# Altium project merged_project.PrjPcb (part 3 of 3)

## Sheet stm32_schematic.SchDoc
size A3; SheetNumber: 3; SheetTotal: 3
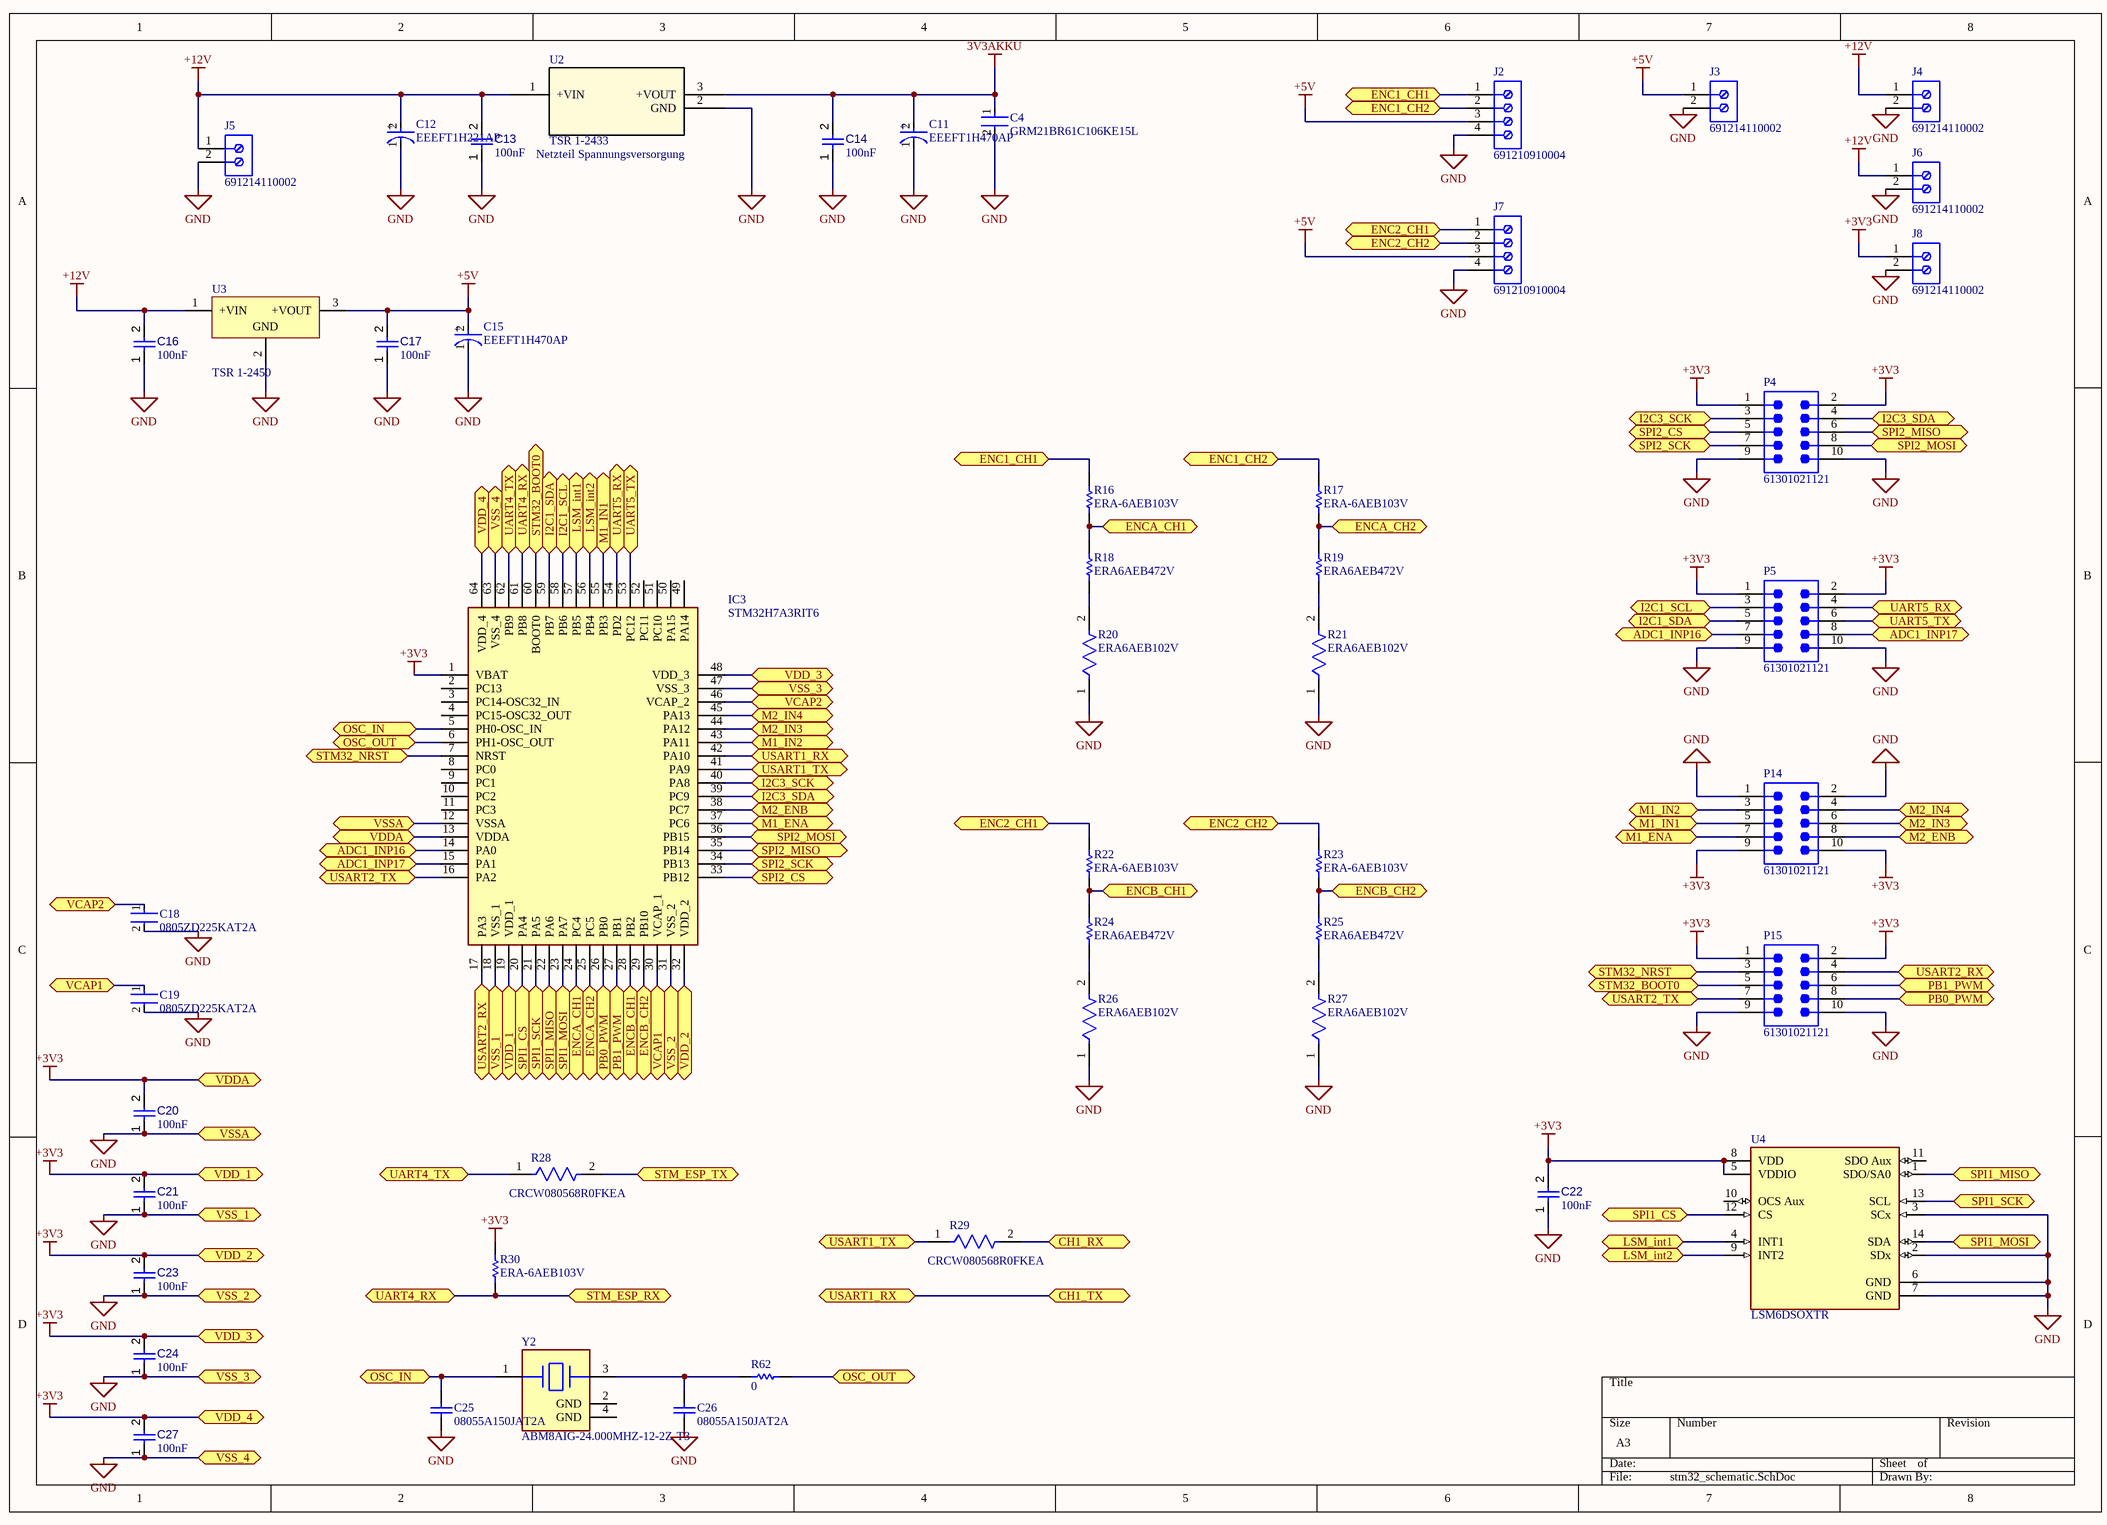
[diagram p4: stm32_schematic.SchDoc]

### Parts
C4  GRM21BR61C106KE15L  [FP-GRM21B-0_1-IPC_C]
C11  EEEFT1H470AP  [FP-FTD-MFG]
C12  EEEFT1H221AP  [FP-FTF-MFG]
C13  value 100nF  [CAPC2013X95X50LL10T25]  (hidden comment: Capacitor 100 nF +/-10% 50 V 0805)
C14  value 100nF  [CAPC2013X95X50LL10T25]  (hidden comment: Capacitor 100 nF +/-10% 50 V 0805)
C15  EEEFT1H470AP  [FP-FTD-MFG]
C16  value 100nF  [CAPC2013X95X50LL10T25]  (hidden comment: Capacitor 100 nF +/-10% 50 V 0805)
C17  value 100nF  [CAPC2013X95X50LL10T25]  (hidden comment: Capacitor 100 nF +/-10% 50 V 0805)
C18  0805ZD225KAT2A  [FP-0805-L_2_01_0_2-W_1_25-IPC_B]
C19  0805ZD225KAT2A  [FP-0805-L_2_01_0_2-W_1_25-IPC_B]
C20  value 100nF  [CAPC2013X95X50LL10T25]  (hidden comment: Capacitor 100 nF +/-10% 50 V 0805)
C21  value 100nF  [CAPC2013X95X50LL10T25]  (hidden comment: Capacitor 100 nF +/-10% 50 V 0805)
C22  value 100nF  [CAPC2013X95X50LL10T25]  (hidden comment: Capacitor 100 nF +/-10% 50 V 0805)
C23  value 100nF  [CAPC2013X95X50LL10T25]  (hidden comment: Capacitor 100 nF +/-10% 50 V 0805)
C24  value 100nF  [CAPC2013X95X50LL10T25]  (hidden comment: Capacitor 100 nF +/-10% 50 V 0805)
C25  08055A150JAT2A  [CAPC2013X140X50LL20T25]
C26  08055A150JAT2A  [CAPC2013X140X50LL20T25]
C27  value 100nF  [CAPC2013X95X50LL10T25]  (hidden comment: Capacitor 100 nF +/-10% 50 V 0805)
IC3  STM32H7A3RIT6  [QFP50P1200X1200X160-64N]
J2  691210910004  [691210910004]
J3  691214110002  [691214110002]
J4  691214110002  [691214110002]
J5  691214110002  [691214110002]
J6  691214110002  [691214110002]
J7  691210910004  [691210910004]
J8  691214110002  [691214110002]
P4  61301021121  [61301021121]
P5  61301021121  [61301021121]
P14  61301021121  [61301021121]
P15  61301021121  [61301021121]
R16  ERA-6AEB103V  [RESC2013X60X40LL20T25_A]
R17  ERA-6AEB103V  [RESC2013X60X40LL20T25_A]
R18  ERA6AEB472V  [RESC2013X60X40ML20T25]
R19  ERA6AEB472V  [RESC2013X60X40ML20T25]
R20  ERA6AEB102V  [FP-ERA6A-IPC_C]
R21  ERA6AEB102V  [FP-ERA6A-IPC_C]
R22  ERA-6AEB103V  [RESC2013X60X40LL20T25_A]
R23  ERA-6AEB103V  [RESC2013X60X40LL20T25_A]
R24  ERA6AEB472V  [RESC2013X60X40ML20T25]
R25  ERA6AEB472V  [RESC2013X60X40ML20T25]
R26  ERA6AEB102V  [FP-ERA6A-IPC_C]
R27  ERA6AEB102V  [FP-ERA6A-IPC_C]
R28  CRCW080568R0FKEA  [FP-CRCW0805-e3-IPC_C]
R29  CRCW080568R0FKEA  [FP-CRCW0805-e3-IPC_C]
R30  ERA-6AEB103V  [RESC2013X60X40LL20T25_A]
R62  value 0  [RESC2013X60X35ML10T20]  (hidden comment: Resistor 0R +/- 5% 0805 125 mW)
U2  TSR 1-2433  [TSR1-SINGLE_TRP]
U3  TSR 1-2450  [TRACO-SIP-3_V]
U4  LSM6DSOXTR  [FP-LGA-14L-DM00249496-MFG]
Y2  ABM8AIG-24.000MHZ-12-2Z-T3  [FP-ABM8AIG-MFG]

### Ports
ADC1_INP16 (bidir), ADC1_INP17 (bidir), CH1_RX (bidir), CH1_TX (bidir), ENC1_CH1 (bidir), ENC1_CH2 (bidir), ENC2_CH1 (bidir), ENC2_CH2 (bidir), ENCA_CH1 (bidir), ENCA_CH2 (bidir), ENCB_CH1 (bidir), ENCB_CH2 (bidir), I2C1_SCL (bidir), I2C1_SDA (bidir), I2C3_SCK (bidir), I2C3_SDA (bidir), LSM_int1 (bidir), LSM_int2 (bidir), M1_ENA (bidir), M1_IN1 (bidir), M1_IN2 (bidir), M2_ENB (bidir), M2_IN3 (bidir), M2_IN4 (bidir), OSC_IN (bidir), OSC_OUT (bidir), PB0_PWM (bidir), PB1_PWM (bidir), SPI1_CS (bidir), SPI1_MISO (bidir), SPI1_MOSI (bidir), SPI1_SCK (bidir), SPI2_CS (bidir), SPI2_MISO (bidir), SPI2_MOSI (bidir), SPI2_SCK (bidir), STM32_BOOT0 (bidir), STM32_NRST (bidir), STM_ESP_RX (bidir), STM_ESP_TX (bidir), UART4_RX (bidir), UART4_TX (bidir), UART5_RX (bidir), UART5_TX (bidir), USART1_RX (bidir), USART1_TX (bidir), USART2_RX (bidir), USART2_TX (bidir), VCAP1 (bidir), VCAP2 (bidir), VDD_1 (bidir), VDD_2 (bidir), VDD_3 (bidir), VDD_4 (bidir), VDDA (bidir), VSS_1 (bidir), VSS_2 (bidir), VSS_3 (bidir), VSS_4 (bidir), VSSA (bidir)

### Nets
3V3AKKU: C4.1 C11.2(A) C14.2 U2.3(+VOUT)
+3V3: C20.2 C21.2 C22.2 C23.2 C24.2 C27.2 IC3.1(VBAT) IC3.13(VDDA) IC3.19(VDD_1) IC3.32(VDD_2) IC3.48(VDD_3) IC3.64(VDD_4) J8.1 P4.1 P4.2 P5.1 P5.2 P14.9 P14.10 P15.1 P15.2 R30.2 U4.5(VDDIO) U4.8(VDD) ; port VDDA, port VDD_1, port VDD_2, port VDD_3, port VDD_4
+5V: C15.2(A) C17.2 J2.3 J3.1 J7.3 U3.3(+VOUT)
+12V: C12.2(A) C13.2 C16.2 J4.1 J5.1 J6.1 U2.1(+VIN) U3.1(+VIN)
GND: C4.2 C11.1(C) C12.1(C) C13.1 C14.1 C15.1(C) C16.1 C17.1 C18.2 C19.2 C20.1 C21.1 C22.1 C23.1 C24.1 C25.1 C26.1 C27.1 IC3.12(VSSA) IC3.18(VSS_1) IC3.31(VSS_2) IC3.47(VSS_3) IC3.63(VSS_4) J2.4 J3.2 J4.2 J5.2 J6.2 J7.4 J8.2 P4.9 P4.10 P5.9 P5.10 P14.1 P14.2 P15.9 P15.10 R20.1 R21.1 R26.1 R27.1 U2.2(GND) U3.2(GND) U4.2(SDx) U4.3(SCx) U4.6(GND) U4.7(GND) ; port VSSA, port VSS_1, port VSS_2, port VSS_3, port VSS_4
NetC18_1: C18.1 IC3.46(VCAP_2) ; port VCAP2
NetC19_1: C19.1 IC3.30(VCAP_1) ; port VCAP1
NetC25_2: C25.2 IC3.5(PH0-OSC_IN) Y2.1 ; port OSC_IN
NetC26_2: C26.2 R62.1 Y2.3
NetIC3_6: IC3.6(PH1-OSC_OUT) R62.2 ; port OSC_OUT
NetIC3_7: IC3.7(NRST) P15.3 ; port STM32_NRST
NetIC3_14: IC3.14(PA0) P5.7 ; port ADC1_INP16
NetIC3_15: IC3.15(PA1) P5.8 ; port ADC1_INP17
NetIC3_16: IC3.16(PA2) P15.7 ; port USART2_TX
NetIC3_17: IC3.17(PA3) P15.4 ; port USART2_RX
NetIC3_20: IC3.20(PA4) U4.12(CS) ; port SPI1_CS
NetIC3_21: IC3.21(PA5) U4.13(SCL) ; port SPI1_SCK
NetIC3_22: IC3.22(PA6) U4.1(SDO/SA0) ; port SPI1_MISO
NetIC3_23: IC3.23(PA7) U4.14(SDA) ; port SPI1_MOSI
NetIC3_24: IC3.24(PC4) R16.1 R18.2 ; port ENCA_CH1
NetIC3_25: IC3.25(PC5) R17.1 R19.2 ; port ENCA_CH2
NetIC3_26: IC3.26(PB0) P15.8 ; port PB0_PWM
NetIC3_27: IC3.27(PB1) P15.6 ; port PB1_PWM
NetIC3_28: IC3.28(PB2) R22.1 R24.2 ; port ENCB_CH1
NetIC3_29: IC3.29(PB10) R23.1 R25.2 ; port ENCB_CH2
NetIC3_33: IC3.33(PB12) P4.5 ; port SPI2_CS
NetIC3_34: IC3.34(PB13) P4.7 ; port SPI2_SCK
NetIC3_35: IC3.35(PB14) P4.6 ; port SPI2_MISO
NetIC3_36: IC3.36(PB15) P4.8 ; port SPI2_MOSI
NetIC3_37: IC3.37(PC6) P14.7 ; port M1_ENA
NetIC3_38: IC3.38(PC7) P14.8 ; port M2_ENB
NetIC3_39: IC3.39(PC9) P4.4 ; port I2C3_SDA
NetIC3_40: IC3.40(PA8) P4.3 ; port I2C3_SCK
NetIC3_41: IC3.41(PA9) R29.1 ; port USART1_TX
NetIC3_42: IC3.42(PA10) ; port CH1_TX, port USART1_RX
NetIC3_43: IC3.43(PA11) P14.3 ; port M1_IN2
NetIC3_44: IC3.44(PA12) P14.6 ; port M2_IN3
NetIC3_45: IC3.45(PA13) P14.4 ; port M2_IN4
NetIC3_53: IC3.53(PC12) P5.6 ; port UART5_TX
NetIC3_54: IC3.54(PD2) P5.4 ; port UART5_RX
NetIC3_55: IC3.55(PB3) P14.5 ; port M1_IN1
NetIC3_56: IC3.56(PB4) U4.9(INT2) ; port LSM_int2
NetIC3_57: IC3.57(PB5) U4.4(INT1) ; port LSM_int1
NetIC3_58: IC3.58(PB6) P5.3 ; port I2C1_SCL
NetIC3_59: IC3.59(PB7) P5.5 ; port I2C1_SDA
NetIC3_60: IC3.60(BOOT0) P15.5 ; port STM32_BOOT0
NetIC3_61: IC3.61(PB8) R30.1 ; port STM_ESP_RX, port UART4_RX
NetIC3_62: IC3.62(PB9) R28.1 ; port UART4_TX
NetJ2_1: J2.1 R16.2 ; port ENC1_CH1
NetJ2_2: J2.2 R17.2 ; port ENC1_CH2
NetJ7_1: J7.1 R22.2 ; port ENC2_CH1
NetJ7_2: J7.2 R23.2 ; port ENC2_CH2
NetR18_1: R18.1 R20.2
NetR19_1: R19.1 R21.2
NetR24_1: R24.1 R26.2
NetR25_1: R25.1 R27.2
NetR28_2: R28.2 ; port STM_ESP_TX
NetR29_2: R29.2 ; port CH1_RX

Not connected (* = marked no-connect by the designer): IC3 2(PC13) 3(PC14-OSC32_IN) 4(PC15-OSC32_OUT) 8(PC0) 9(PC1) 10(PC2) 11(PC3) 49(PA14) 50(PA15) 51(PC10) 52(PC11); U4 10(OCS_Aux) 11(SDO_Aux); Y2 2(GND) 4(GND)

### Notes on the sheet
- Netzteil Spannungsversorgung
- (in symbol CMP-05427-000060-1) +
- (in symbol CMP-05427-000092-1) +

### Library data of the parts
C4 = CMP-2007-03453-2: Chip Multilayer Ceramic Capacitors for General Purpose, 0805, 10uF, X5R, 15%, 10%, 16V; Radiation Hardening: No; Thickness: 0.053inch; Voltage Rating (DC): 16V; Lead Free: Lead Free; Package Quantity: 1; Width: 1.25mm; Case Code (Imperial): 0805; Depth: 1.25mm; Packaging: Tape and Reel; Dielectric: X5R; Max Operating Temperature: 85°C; Tolerance: 10%; Voltage Rating: 16V; Voltage: 16V; Capacitance: 10uF; Height: 1.25mm; Case Code (Metric): 2012; Material: Ceramic; Mount: Surface Mount; Case/Package: 0805; REACH SVHC: No SVHC; Length: 2mm; Min Operating Temperature: -55°C; Termination: SMD/SMT
C11 C15 = CMP-05427-000060-1: CAP ALUM 47UF 20% 50V SMD; ESR (Equivalent Series Resistance): 680mR; Ripple Current (AC): 195mA; Dielectric Material: Aluminium; Leakage Current: 23.5uA; Life (Hours): 2000Hour; Lead Diameter: 0.65mm; Lead Pitch: 1.8mm; Voltage: 50V; Min Operating Temperature: -55°C; Capacitance: 47uF; Radiation Hardening: No; Series: FT; Contact Plating: Tin; Mount: Surface Mount; REACH SVHC: No SVHC; RoHS Compliant: Yes; Package Quantity: 1; Tolerance: 20%; Construction: Cylindrical; Max Operating Temperature: 105°C; Packaging: Tape and Reel; Length: 5.8mm; Number of Pins: 2; Diameter: 6.3mm; Voltage Rating (DC): 50V; Voltage Rating: 50V; Height - Seated (Max): 0.24inch; Height: 5.8mm; Lead Free: Lead Free; Case/Package: Radial; Ripple Current: 195mA; Termination: SMD/SMT
C12 = CMP-05427-000092-1: CAP ALUM 220UF 20% 50V SMD; Ripple Current (AC): 670mA; Dielectric Material: Aluminium; Life (Hours): 2000Hour; Leakage Current: 110uA; Lead Diameter: 0.9mm; ESR (Equivalent Series Resistance): 180mR; REACH SVHC: No SVHC; Voltage Rating (DC): 50V; Radiation Hardening: No; Capacitance: 220uF; Length: 10.2mm; Construction: Cylindrical; Case/Package: Radial; Series: FT; Lead Free: Lead Free; Voltage Rating: 50V; Tolerance: 20%; Contact Plating: Tin; Number of Pins: 2; Height - Seated (Max): 0.413inch; RoHS Compliant: Yes; Diameter: 8mm; Ripple Current: 670mA; Lead Pitch: 3.1mm; Termination: SMD/SMT; Mount: Surface Mount; Min Operating Temperature: -55°C; Max Operating Temperature: 105°C; Voltage: 50V; Height: 10.2mm; Package Quantity: 500; Packaging: Tape and Reel
C13 C14 C16 C17 C20-C24 C27 = CMP-001-00018-6: Chip Capacitor, 100 nF, +/- 10%, 50 V, 0805 (2012 Metric); Capacitor Type: Ceramic; Voltage Rating: 50V; Pins: 2; Max Operating Temperature: 125°C; Min Operating Temperature: -55°C; Mounting Technology: SM; Case/Package: 0805; RoHS Compliant: True; Tolerance: 10%
C18 C19 = CMP-2000-05810-2: General Purpose Ceramic Capacitor, 0805, 2.2uF, 10%, X5R, 15%, 10V; Insulation Resistance: 500MR; Dissipation Factor: 5%; Termination: SMD/SMT; Length: 2.01mm; Lead Free: Lead Free; Voltage: 10V; Height: 1.4mm; Contact Plating: Tin; Dielectric: X5R; Voltage Rating (DC): 10V; REACH SVHC: No SVHC; Voltage Rating: 10V; Depth: 1.25mm; Min Operating Temperature: -55°C; Tolerance: 10%; Case Code (Metric): 2012; Max Operating Temperature: 85°C; Radiation Hardening: No; Dielectric Material: Ceramic; Packaging: Tape and Reel; Construction: Flat; Case Code (Imperial): 0805; RoHS Compliant: Yes; Package Quantity: 1; Capacitance: 2.2uF; Series: -; Size: 1.4mm; Number of Pins: 2; Width: 0.049inch; Mount: Surface Mount; Thickness: 0.055inch; Case/Package: 0805
C25 C26 = CMP-2007-04621-1: Manufacturer: AVX Interconnect / Elco; Part Number: 08055A150JAT2A
IC3 = STM32H7A3RIT6: Integrated Circuit; Manufacturer_Name: STMicroelectronics; Datasheet Link: https://www.st.com/resource/en/datasheet/stm32h7a3ai.pdf; Height: 1.6mm; Manufacturer_Part_Number: STM32H7A3RIT6; Mouser Part Number: 511-STM32H7A3RIT6; Mouser Price/Stock: https://www.mouser.co.uk/ProductDetail/STMicroelectronics/STM32H7A3RIT6?qs=xZ%2FP%252Ba9zWqZAEQXxnLVEdg%3D%3D; Arrow Part Number: STM32H7A3RIT6; Arrow Price/Stock: https://www.arrow.com/en/products/stm32h7a3rit6/stmicroelectronics
J2 J7 = CMP-1502-02458-2: NexarPartId: 105950651
J3-J6 J8 = CMP-1502-02464-2: NexarPartId: 18818288; Plating: Brass, Steel; Current: 10A; Pitch: 3.5052mm; Number of Levels: 1; Number of Contacts: 2; Wire Gauge (Min): 16AWG; Voltage: 300V; Wire Gauge (Max): 24AWG; Stripping Length: -6mm; Number of Pins: 2; Number of Rows: 1; REACH SVHC: Unknown; RoHS: Compliant; Housing Material: Nylon; Termination: Screw; Mount: Through Hole; Contact Plating: Brass, Tin; Number of Positions Per Level: 2; Color: Blue, Green; Width: 7.9mm; Voltage Rating: 300V; Length: 7.4mm; Current Rating: 10A; Wire/Cable Gauge: 24AWG; Packaging: Box; Max Operating Temperature: 105°C; Lead Pitch: 3.5mm; Height: 8.7mm; Contact Material: Brass; Min Operating Temperature: -40°C
P4 P5 P14 P15 = CMP-1502-01084-3: NexarPartId: 18818163; Connector Type: Male Pin; Insulation Resistance: 1GΩ; Row Spacing: 2.54mm; Insulation: Insulated; Number of Positions: 10; Current Rating: 3A; Voltage Rating: 250V; Gender: Male; Contact Resistance: 20mΩ; Contact Gender: Male; Number of Rows: 2; Min Operating Temperature: -40°C; Mount: Through Hole; Packaging: Bulk; Length: 12.7mm; Pitch: 2.54mm; RoHS: Compliant; Height: 2.54mm; Lead Pitch: 2.54mm; Number of Pins: 10; Housing Material: PBT; Orientation: Vertical; Flammability Rating: UL94 V-0; Termination: Through Hole; Width: 12.7mm; Color: Black; Contact Mating Length: 5.9944mm; Max Operating Temperature: 105°C; Operating Supply Voltage: 250V; Contact Material: Copper; Number of Contacts: 10; Contact Plating: Gold; REACH SVHC: Unknown
R16 R17 R22 R23 R30 = CMP-2001-00582-2: Metal Film Chip Resistor, High Reliability Type, 0.125 W, +/- 0.1%, -55 to 155 degC, 0805 (2012 Metric), RoHS, Tape and Reel; Voltage Rating: 100V; Power Rating: 125mW(1/8W); Brand: Panasonic; Temperature Coefficient: 25PPM/C; Resistance: 10kOhms; Product Category: ThinFilmResistors-SMD; Datasheet Version: 02/2016; Operating Temperature Range: -55Cto+155C; Length: 2mm; Mounting Technology: SurfaceMount; Manufacturer URL: http://www.panasonic.com/; Width: 1.25mm; Packaging: Reel; Product: ThinFilmResistorsSMD; Package / Case: 0805(2012metric); Termination Style: SMD/SMT; Tolerance: 0.1%; Datasheet URL: https://industrial.panasonic.com/cdbs/www-data/pdf/RDM0000/AOA0000C307.pdf; Package Description: 2-Pin Surface Mount Device, Body 2 x 1.25 mm; Factory Pack Quantity: 5000; Series: ERA-6A; Case Code - mm: 2012; RoHS: Details; Package Reference: 0805; Height: 0.5mm; Manufacturer: Panasonic; Case Code - in: 0805; Type: MetalFilmChipResistors
R18 R19 R24 R25 = CMP-2001-00644-1: Manufacturer: Panasonic; Part Number: ERA6AEB472V
R20 R21 R26 R27 = CMP-2001-00581-2: RES 1K OHM 0.1% 1/8W 0805; Temperature Coefficient: 25ppm/°C; Resistance: 1kR; Working Voltage: 100V; Max Power Dissipation: 125mW; Height: 0.5mm; Technology: THIN FILM; REACH SVHC: No SVHC; Packaging: Tape and Reel; Length: 2mm; Width: 1.25mm; Resistance Tolerance: 0.1%; Series: ERA-6A; Resistor Type: Thin Film; Number of Pins: 2; Case Code (Metric): 2012; Voltage Rating: 100V; Radiation Hardening: No; Construction: Rectangular; Mount: Surface Mount; Number of Terminations: 2; Case/Package: 0805; Min Operating Temperature: -55°C; Military Standard: Not; RoHS Compliant: Yes; Termination: SMD/SMT; Case Code (Imperial): 0805; Depth: 1.25mm; Power Rating: 125mW; Max Operating Temperature: 155°C; Contact Plating: Tin; Package Quantity: 5000; Tolerance: 0.1%
R28 R29 = CMP-1013-00378-3: RES Thick Film, 68Ω, 1%, 0.125W, 100ppm/°C, 0805; Voltage Rating (DC): 150V; Power Rating: 125mW; Resistance: 68R; Case Code (Metric): 2012; Height: 0.45mm; Depth: 1.25mm; Length: 2mm; Max Power Dissipation: 125mW; Termination: SMD/SMT; Packaging: Tape and Reel; Military Standard: Not; Width: 0.049inch; Radiation Hardening: No; Tolerance: 1%; Package Quantity: 5000; Voltage Rating: 150V; Temperature Coefficient: 100ppm/°C; Number of Terminations: 2; Case Code (Imperial): 0805; Weight: 0.000194oz; Min Operating Temperature: -55°C; Mount: Surface Mount; Case/Package: 0805; Features: Automotive AEC-Q200; Max Operating Temperature: 155°C; Lead Free: Lead Free; Composition: Thick Film; Contact Plating: Tin
R62 = CMP-009-00007-5: Chip Resistor, 0 Ohm, 0.125 W, -55 to 155 degC, 0805 (2012 Metric); Power: 125mW; Voltage Rating: 50V; RoHS Compliant: True; Max Operating Temperature: 155°C; Case/Package: 0805; Mounting Technology: SM; Min Operating Temperature: -55°C; Tolerance: 5%; Pins: 2
U2 = CMP-2000-05426-2: NexarPartId: 9539342; Nominal Output Voltage: 3.3V; Max Input Voltage: 36V; Max Output Power: 3.3W; Min Input Voltage: 4.75V; Nominal Supply Current: 1mA; Output Type: Fixed; Max Output Current: 1A; Min Input Voltage (DC): 5.5V; Efficiency: 79%; Number of Outputs: 1; Isolation: Isolated; Max Input Voltage (DC): 32V; Switching Frequency: 500kHz; Radiation Hardening: No; REACH SVHC: No SVHC; Mount: Through Hole; Height: 10.2mm; Max Operating Temperature: 85°C; RoHS: Compliant; Output Power: 3.3W; Min Supply Voltage: 4.75V; Weight: 1.9g; Power Rating: 3.3W; Number of Pins: 3; Output Current: 1A; Min Operating Temperature: -40°C; Length: 11.7mm; Case/Package: SIP; Output Voltage: 3.3V; Max Supply Voltage: 36V; Depth: 7.6mm; Width: 7.6mm
U3 = CMP-2000-05427-1: DC/DC converter, 5 VDC, 1000 mA, -40 to 85 degC, 3-Pin SIP, RoHS; Manufacturer: Tracopower; Output Voltage Nom.: 5V; Output Current Max: 1A; Product Range: TSR-1Series; DC / DC Converter Mounting: ThroughHole; Output Power Max: 5W; No. of Outputs: 1Output; Input Voltage DC Max: 36V; Approvals & Standards: IEC,UL; Input Voltage DC Min: 6.5V; DC / DC Converter Output Type: Fixed; Depth: 11.7mm; Package Reference: SIP-3; DC / DC Converter Type: SIP; Height: 10.2mm; Width: 7.6mm; Package Description: 3-Pin Single In-line Package, Body 11.7 x 7.6 mm, Pitch 2.54 mm; Manufacturer URL: http://www.tracopower.com/home; Datasheet Version: Jan-15; Datasheet URL: https://datasheet.ciiva.com/6815/tsr1-6815641.pdf
U4 = CMP-12177-000010-1: INEMO INERTIAL MODULE: 3D ACCELE; Manufacturer: STMicroelectronics; Sensor Type: Temperature,Accelerometer,Gyroscope; Accel Range: 2/4/8/16g; Accel Sensitivity: 0.061/0.122/0.244/0.488mV/g; Operating Supply Current: 0.55mA; Gyro Range: 125/250/500/1000/2000°/s; Gyro Sensitivity: 4.375/8.75/17.5/35/70LSB/°/s; Sensor Output: I2C,SPI,Other; Min Supply Voltage: 1.62V; Max Supply Voltage: 3.6V; Octopart: https://octopart.com/lsm6dsoxtr-stmicroelectronics-98102600; Package: LGA-14L-DM00249496; Footprint Url: https://www.st.com/content/ccc/resource/technical/document/technical_note/73/17/9c/16/dd/96/4a/01/CD00134799.pdf/files/CD00134799.pdf/jcr:content/translations/en.CD00134799.pdf; ComponentLink2Description: Datasheet; Mouser Description: LSM6DSOX: 3.6 V 3 Axis Accelerometer Gyroscope iNEMO Inertial Module - LGA-14L; ComponentLink2URL: https://www.st.com/resource/en/datasheet/lsm6dsox.pdf; Temperature Range Low: -40°C; Digikey Description: INEMO INERTIAL MODULE: 3D ACCELE; Lead Free: Yes; Device Class L3: Inertial Measurement Units (IMUs); Category: IC; Device Class L2: Motion Sensors; RoHS: TRUE; Temperature: -40°C to +85°C; Height: 0.86mm; Device Class L1: Sensors; Temperature Range High: +85°C; Manufacturer Part Number: LSM6DSOXTR; Automotive: No
Y2 = CMP-27762-015716-1: Crystal 24MHz ±20ppm (Tol) ±50ppm (Stability) 12pF FUND 50Ω Automotive 4-Pin Ultra Mini-CSMD T/R; ESR (Equivalent Series Resistance): 50R; Series: ABM8AIG; RoHS Compliant: Yes; Load Capacitance: 12pF; Height: 0.031inch; Min Operating Temperature: -40°C; Mount: Surface Mount; Packaging: Cut Tape; Ratings: AEC-Q200; Case/Package: SMD/SMT; Frequency Stability: 50ppm; Max Operating Temperature: 125°C; Length: 0.126inch; Frequency: 24MHz; Frequency Tolerance: 20ppm; Width: 0.098inch

## Nets that join several sheets
3V3AKKU: PCB_USB_UART (C39.2 U7.6), stm32_schematic (C4.1 C11.2 C14.2 U2.3)
+3V3: ESP8266_final (17 pins), PCB_USB_UART (35 pins), stm32_schematic (24 pins)
GND: ESP8266_final (18 pins), PCB_USB_UART (72 pins), stm32_schematic (48 pins)
NetIC2_3: ESP8266_final (IC2.3 P2.1 U1.7), PCB_USB_UART (Q5.3 R60.1 SW8.3)
NetIC2_4: ESP8266_final (IC2.4 R1.1), PCB_USB_UART (U6.6)
NetIC2_5: ESP8266_final (IC2.5 U1.26), PCB_USB_UART (U6.10)
NetIC2_6: ESP8266_final (IC2.6 P3.1 U1.15), PCB_USB_UART (Q4.3 R57.1 SW7.3)
NetIC3_7: PCB_USB_UART (Q3.3 R49.1 SW6.3), stm32_schematic (IC3.7 P15.3)
NetIC3_42: PCB_USB_UART (R48.2), stm32_schematic (IC3.42)
NetIC3_60: PCB_USB_UART (SW5.4), stm32_schematic (IC3.60 P15.5)
NetIC3_61: PCB_USB_UART (U6.7), stm32_schematic (IC3.61 R30.1)
NetR28_2: PCB_USB_UART (U6.9), stm32_schematic (R28.2)
NetR29_2: PCB_USB_UART (U9.17), stm32_schematic (R29.2)